# EAGLE design sx1 (EAGLE 5.11)
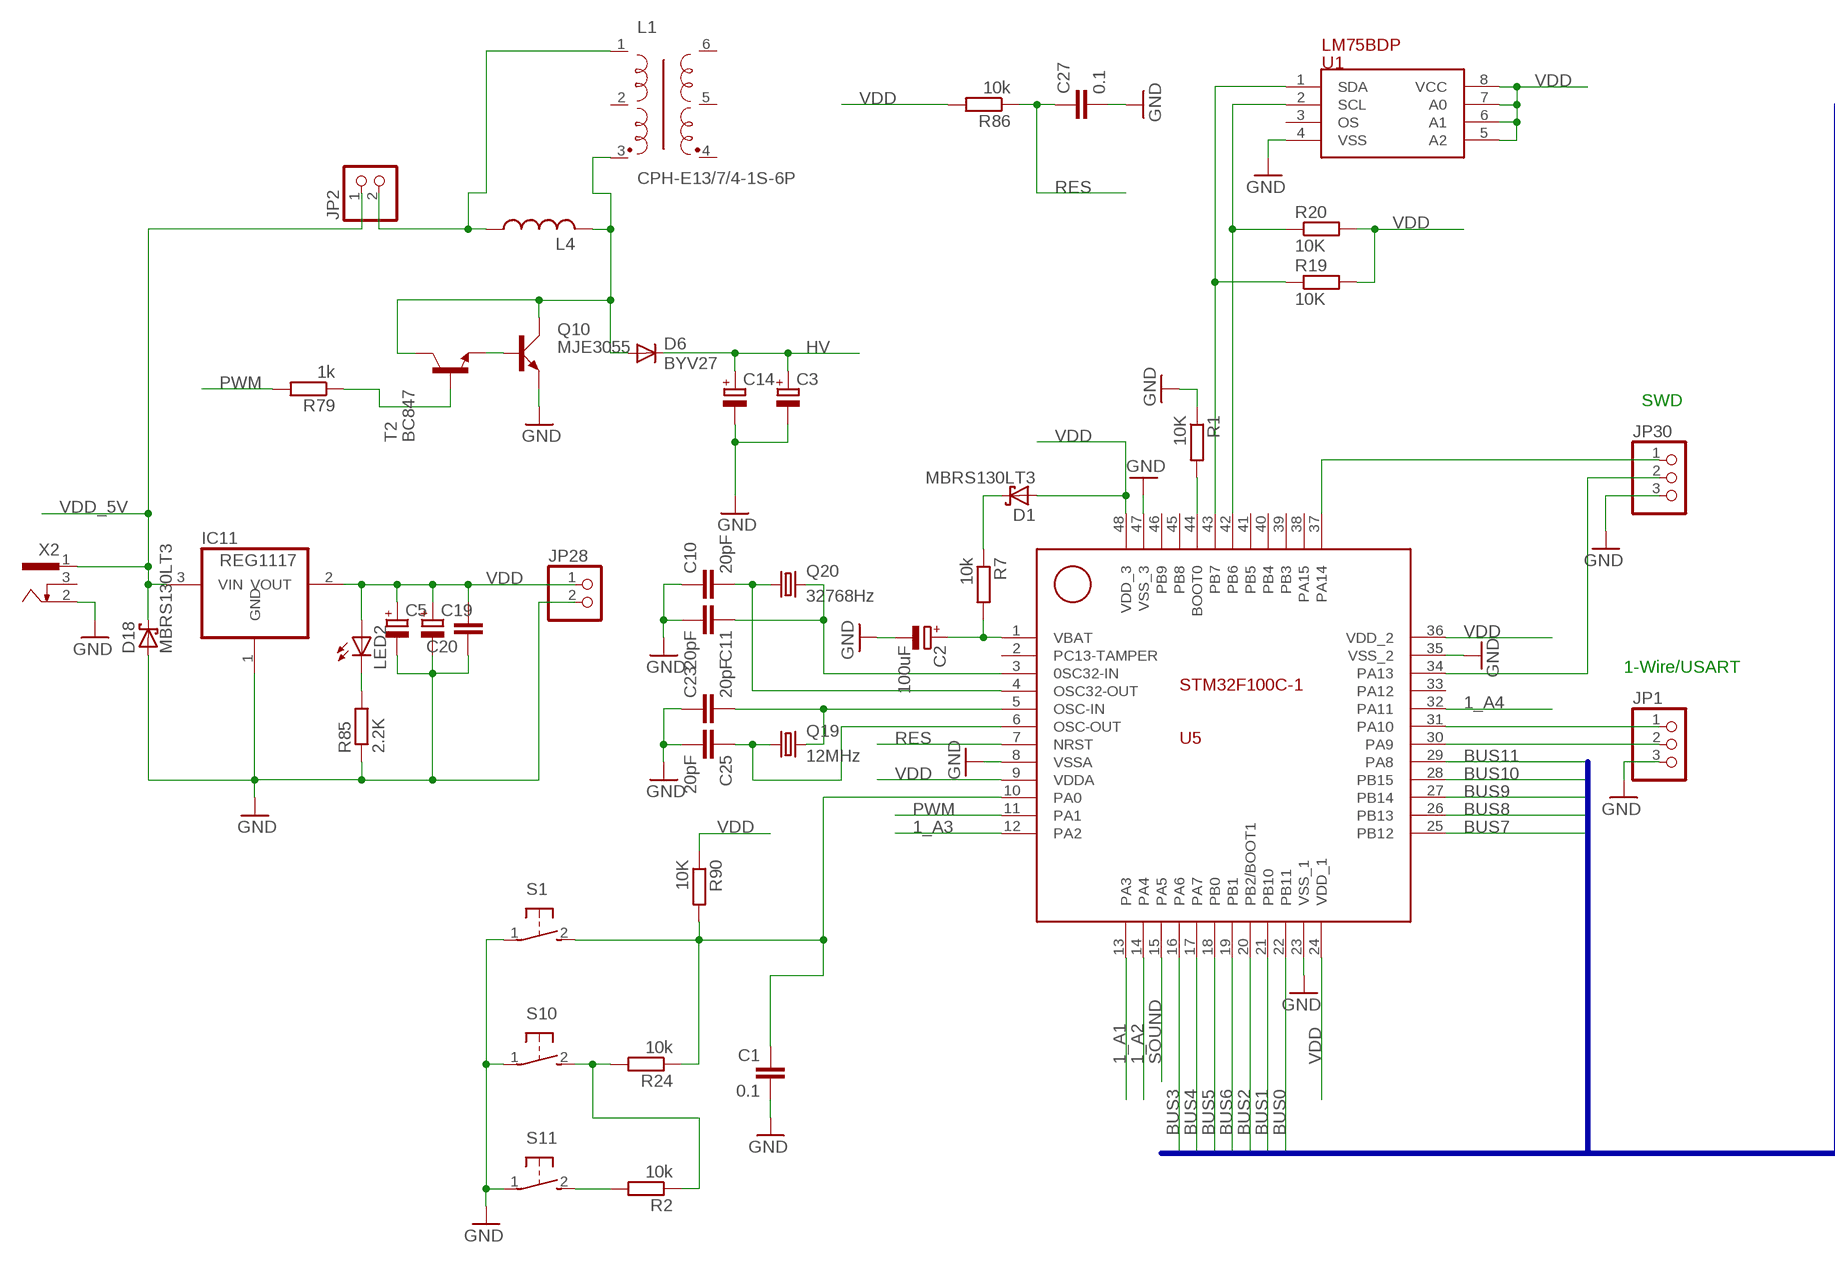
[diagram p0: schematic, sheet 1, part 1 of 2]
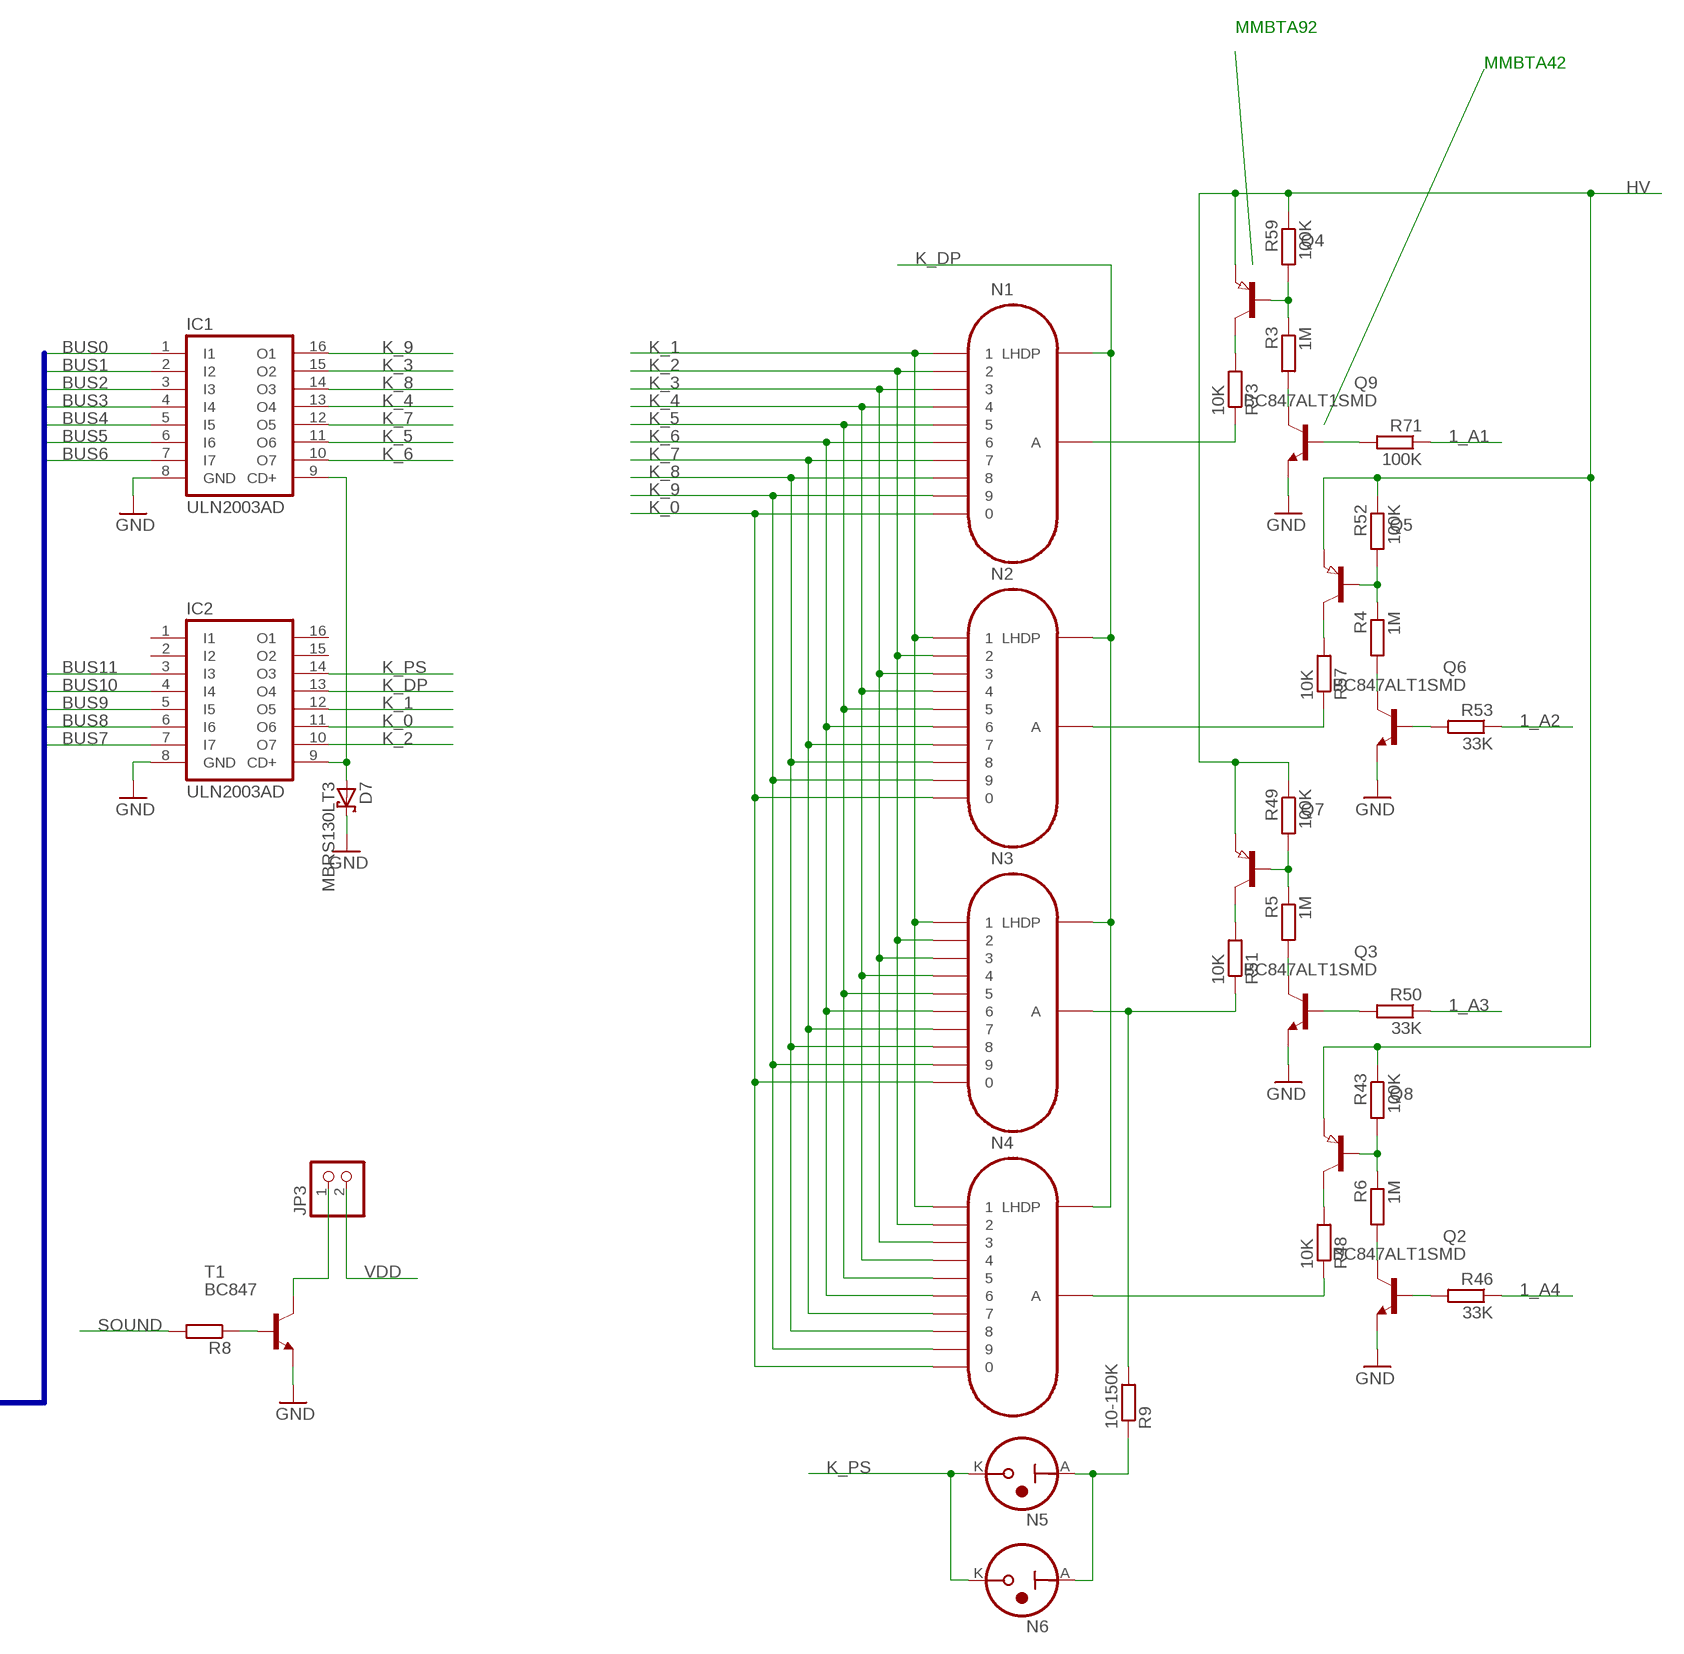
[diagram p1: schematic, sheet 1, part 2 of 2]

## Parts
C1  0.1  C-EUC0805K  [C0805K]
C2  100uF  CPOL-EUSMCC  [SMC_C]
C3  CPOL-EUSANYO_E9  [SANYO-OSCON_E9]
C5  CPOL-EUSMCC  [SMC_C]
C10  20pF  C-EUC0805K  [C0805K]
C11  20pF  C-EUC0805K  [C0805K]
C14  CPOL-EUSMCC  [SMC_C]
C19  CPOL-EUSMCC  [SMC_C]
C20  C-EUC0805K  [C0805K]
C23  20pF  C-EUC0805K  [C0805K]
C25  20pF  C-EUC0805K  [C0805K]
C27  0.1  C-EUC0805K  [C0805K]
D1  MBRS130LT3  [SMB]
D6  BYV27  [SOD57-10]
D7  MBRS130LT3  [SMB]
D18  MBRS130LT3  [SMB]
IC1  ULN2003AD  [SO16]
IC2  ULN2003AD  [SO16]
IC11  REG1117  [SOT223]
JP1  PINHD-1X3  [1X03]
JP2  PINHD-1X2  [1X02]
JP3  PINHD-1X2  [1X02]
JP28  PINHD-1X2  [1X02]
JP30  PINHD-1X3  [1X03]
L1  CPH-E13/7/4-1S-6P  [CPH-E13/7/4-1S-6P]
L4  L-USL4532P  [L4532P]
LED2  LEDCHIPLED_0805  [CHIPLED_0805]
N1  IN-12B  [IN-12]
N2  IN-12B  [IN-12]
N3  IN-12B  [IN-12]
N4  IN-12B  [IN-12]
N5  IN-6  [IN-6]
N6  IN-6  [IN-6]
Q2  BC847ALT1SMD  [SOT23]
Q3  BC847ALT1SMD  [SOT23]
Q4  PNP-TRANSISTOR_SOT23  [SOT23]
Q5  PNP-TRANSISTOR_SOT23  [SOT23]
Q6  BC847ALT1SMD  [SOT23]
Q7  PNP-TRANSISTOR_SOT23  [SOT23]
Q8  PNP-TRANSISTOR_SOT23  [SOT23]
Q9  BC847ALT1SMD  [SOT23]
Q10  MJE3055  [TO220AV]
Q19  12MHz  CRYSTALHC49S  [HC49/S]
Q20  32768Hz  CRYSTALTC26H  [TC26H]
R1  10K  R-EU_R0805  [R0805]
R2  10k  R-EU_R0805  [R0805]
R3  1M  R-EU_R0805  [R0805]
R4  1M  R-EU_R0805  [R0805]
R5  1M  R-EU_R0805  [R0805]
R6  1M  R-EU_R0805  [R0805]
R7  10k  R-EU_R0805  [R0805]
R8  R-EU_R0805  [R0805]
R9  10-150K  R-EU_R0805  [R0805]
R19  10K  R-EU_R0805  [R0805]
R20  10K  R-EU_R0805  [R0805]
R24  10k  R-EU_R0805  [R0805]
R43  100K  R-EU_R0805  [R0805]
R46  33K  R-EU_R0805  [R0805]
R48  10K  R-EU_R0805  [R0805]
R49  100K  R-EU_R0805  [R0805]
R50  33K  R-EU_R0805  [R0805]
R51  10K  R-EU_R0805  [R0805]
R52  100K  R-EU_R0805  [R0805]
R53  33K  R-EU_R0805  [R0805]
R57  10K  R-EU_R0805  [R0805]
R59  100K  R-EU_R0805  [R0805]
R71  100K  R-EU_R0805  [R0805]
R73  10K  R-EU_R0805  [R0805]
R79  1k  R-EU_R0805  [R0805]
R85  2.2K  R-EU_R0805  [R0805]
R86  10k  R-EU_R0805  [R0805]
R90  10K  R-EU_R0805  [R0805]
S1  31-XX  [B3F-31XX]
S10  31-XX  [B3F-31XX]
S11  31-XX  [B3F-31XX]
T1  BC847  [SOT23]
T2  BC847  [SOT23]
U1  LM75BDP  [TSSOP8]
U5  STM32F100C-1  [LQFP48]
X2  733980-62  [733980-62]

## Nets
1_A1: R71.1 U5.13(PA3)
1_A2: R53.1 U5.14(PA4)
1_A3: R50.1 U5.12(PA2)
1_A4: R46.1 U5.32(PA11)
BUS0: IC1.1(I1) U5.22(PB11)
BUS1: IC1.2(I2) U5.21(PB10)
BUS2: IC1.3(I3) U5.20(PB2/BOOT1)
BUS3: IC1.4(I4) U5.16(PA6)
BUS4: IC1.5(I5) U5.17(PA7)
BUS5: IC1.6(I6) U5.18(PB0)
BUS6: IC1.7(I7) U5.19(PB1)
BUS7: IC2.7(I7) U5.25(PB12)
BUS8: IC2.6(I6) U5.26(PB13)
BUS9: IC2.5(I5) U5.27(PB14)
BUS10: IC2.4(I4) U5.28(PB15)
BUS11: IC2.3(I3) U5.29(PA8)
GND: C1.2 C2.- C3.- C5.- C10.1 C11.2 C14.- C19.- C20.1 C23.1 C25.2 C27.2 D7.C D18.A IC1.8(GND) IC2.8(GND) IC11.1(GND) JP1.3 JP28.2 JP30.3 Q2.2(E) Q3.2(E) Q6.2(E) Q9.2(E) Q10.E R1.1 R85.1 S1.1(P) S10.1(P) S11.1(P) T1.2(E) U1.4(VSS) U5.8(VSSA) U5.23(VSS_1) U5.35(VSS_2) U5.47(VSS_3) X2.2
HV: C3.+ C14.+ D6.C Q4.2(E) Q5.2(E) Q7.2(E) Q8.2(E) R43.1 R49.1 R52.1 R59.1
K_0: IC2.11(O6) N1.0 N2.0 N3.0 N4.0
K_1: IC2.12(O5) N1.1 N2.1 N3.1 N4.1
K_2: IC2.10(O7) N1.2 N2.2 N3.2 N4.2
K_3: IC1.15(O2) N1.3 N2.3 N3.3 N4.3
K_4: IC1.13(O4) N1.4 N2.4 N3.4 N4.4
K_5: IC1.11(O6) N1.5 N2.5 N3.5 N4.5
K_6: IC1.10(O7) N1.6 N2.6 N3.6 N4.6
K_7: IC1.12(O5) N1.7 N2.7 N3.7 N4.7
K_8: IC1.14(O3) N1.8 N2.8 N3.8 N4.8
K_9: IC1.16(O1) N1.9 N2.9 N3.9 N4.9
K_DP: IC2.13(O4) N1.LHDP N2.LHDP N3.LHDP N4.LHDP
K_PS: IC2.14(O3) N5.K N6.K
N$1: Q10.B T2.2(E)
N$2: D6.A L1.3 L4.2 Q10.C T2.3(C)
N$3: Q8.1(B) R6.1 R43.2
N$4: Q2.1(B) R46.2
N$5: Q8.3(C) R48.2
N$6: Q7.1(B) R5.1 R49.2
N$7: C2.+ R7.2 U5.1(VBAT)
N$8: D1.C R7.1
N$9: R79.1 T2.1(B)
N$10: R19.1 U1.1(SDA) U5.43(PB7)
N$11: R20.1 U1.2(SCL) U5.42(PB6)
N$12: R8.1 T1.1(B)
N$13: JP1.2 U5.30(PA9)
N$14: JP3.1 T1.3(C)
N$15: JP2.2 L1.1 L4.1
N$17: N5.A N6.A R9.1
N$19: Q3.1(B) R50.2
N$20: Q7.3(C) R51.2
N$22: Q9.3(C) R3.2
N$23: Q3.3(C) R5.2
N$24: Q2.3(C) R6.2
N$25: Q6.3(C) R4.2
N$26: R1.2 U5.44(BOOT0)
N$27: R2.2 S11.2(S)
N$28: JP30.2 U5.34(PA13)
N$29: JP30.1 U5.37(PA14)
N$30: JP1.1 U5.31(PA10)
N$31: R2.1 R24.2 S10.2(S)
N$32: N3.A R9.2 R51.1
N$36: C25.1 Q19.1 U5.6(OSC-OUT)
N$39: C23.2 Q19.2 U5.5(OSC-IN)
N$42: C11.1 Q20.2 U5.3(0SC32-IN)
N$43: C10.2 Q20.1 U5.4(OSC32-OUT)
N$44: Q5.1(B) R4.1 R52.2
N$61: Q6.1(B) R53.2
N$62: Q5.3(C) R57.2
N$72: Q4.1(B) R3.1 R59.2
N$76: Q9.1(B) R71.2
N$87: Q4.3(C) R73.2
N$95: N2.A R57.1
N$97: N1.A R73.1
N$99: D7.A IC1.9(CD+) IC2.9(CD+)
N$105: N4.A R48.1
N$157: C1.1 R24.1 R90.2 S1.2(S) U5.10(PA0)
N$163: LED2.C R85.2
PWM: R79.2 U5.11(PA1)
RES: C27.1 R86.1 U5.7(NRST)
SOUND: R8.2 U5.15(PA5)
VDD: C5.+ C19.+ C20.2 D1.A IC11.2(VOUT) JP3.2 JP28.1 LED2.A R19.2 R20.2 R86.2 R90.1 U1.5(A2) U1.6(A1) U1.7(A0) U1.8(VCC) U5.9(VDDA) U5.24(VDD_1) U5.36(VDD_2) U5.48(VDD_3)
VDD_5V: D18.C IC11.3(VIN) JP2.1 X2.1
Unconnected: IC2.1(I1) IC2.2(I2) IC2.15(O2) IC2.16(O1) L1.2 L1.4 L1.5 L1.6 U1.3(OS) U5.2(PC13-TAMPER) U5.33(PA12) U5.38(PA15) U5.39(PB3) U5.40(PB4) U5.41(PB5) U5.45(PB8) U5.46(PB9) X2.3

## Buses
BUS[0..12]

## Notes on the sheet
- MMBTA92
- MMBTA42
- SWD
- 1-Wire/USART

## Library data of the parts
C1 C10 C11 C20 C23 C25 C27 = rcl:C-EU: CAPACITOR, European symbol
C2 C3 C5 C14 C19 = rcl:CPOL-EU: POLARIZED CAPACITOR, European symbol
D1 D7 D18 = diode:MBRS130LT3: Schottky Power Rectifier Source: http://www.onsemi.com/pub/Collateral/MBRS130LT3-D.PDF
D6 = diode:BYV27: DIODE ultra fast
IC1 IC2 = uln-udn:ULN2003A: DRIVER ARRAY
IC11 = burr-brown:REG1117: 800mA and 1A Low Dropout (LDO) Positive Regulator 1.8V, 2.5V, 2.85V, 3.3V, 5V, and Adj; MPN: REG1117; OC_FARNELL: 1097566; OC_NEWARK: 14P6981
JP1 JP30 = pinhead:PINHD-1X3: PIN HEADER
JP2 JP3 JP28 = pinhead:PINHD-1X2: PIN HEADER
L1 = inductors:CPH-E13/7/4-1S-6P: 6-pins E13/7/4 coil former (EF12.6) Source: Ferroxcube Ecore.pdf
L4 = rcl:L-US: INDUCTOR, American symbol
LED2 = led:LED: LED OSRAM: - CHIPLED LG R971, LG N971, LY N971, LG Q971, LY Q971, LO R971, LY R971 LH N974, LH R974 LS Q976, LO Q976, LY Q976 LO Q996 - Hyper CHIPLED LW Q18S LB Q993, LB Q99A, LB R99A - SideLED LS A670, LO A670, LY A670, LG A670, LP A670 LB A673, LV A673, LT A673, LW A673 LH A674 LY A675 LS A676, LA A676, LO A676, LY A676, LW A676 LS A679, LY A679, LG A679 - Hyper Micro SIDELED® LS Y876, LA Y876, LO Y876, LY Y876 LT Y87S - SmartLED LW L88C, LW L88S LB L89C, LB L89S, LG L890 LS L89K, LO L89K, LY L89K LS L896, LA L896, LO L896, LY L896 - TOPLED LS T670, LO T670, LY T670, LG T670, LP T670 LSG T670, LSP T670, LSY T670, LOP T670, LYG T670 LG T671, LOG T671, LSG T671 LB T673, LV T673, LT T673, LW T673 LH T674 LS T676, LA T676, LO T676, LY T676, LB T676, LH T676, LSB T676, LW T676 LB T67C, LV T67C, LT T67C, LS T67K, LO T67K, LY T67K, LW E67C LS E67B, LA E67B, LO E67B, LY E67B, LB E67C, LV E67C, LT E67C LW T67C LS T679, LY T679, LG T679 LS T770, LO T770, LY T770, LG T770, LP T770 LB T773, LV T773, LT T773, LW T773 LH T774 LS E675, LA E675, LY E675, LS T675 LS T776, LA T776, LO T776, LY T776, LB T776 LHGB T686 LT T68C, LB T68C - Hyper Mini TOPLED® LB M676 - Mini TOPLED Santana® LG M470 LS M47K, LO M47K, LY M47K Source: http://www.osram.convergy.de LUXEON: - LUMILED® LXK2-PW12-R00, LXK2-PW12-S00, LXK2-PW14-U00, LXK2-PW14-V00 LXK2-PM12-R00, LXK2-PM12-S00, LXK2-PM14-U00 LXK2-PE12-Q00, LXK2-PE12-R00, LXK2-PE12-S00, LXK2-PE14-T00, LXK2-PE14-U00 LXK2-PB12-K00, LXK2-PB12-L00, LXK2-PB12-M00, LXK2-PB14-N00, LXK2-PB14-P00, LXK2-PB14-Q00 LXK2-PR12-L00, LXK2-PR12-M00, LXK2-PR14-Q00, LXK2-PR14-R00 LXK2-PD12-Q00, LXK2-PD12-R00, LXK2-PD12-S00 LXK2-PH12-R00, LXK2-PH12-S00 LXK2-PL12-P00, LXK2-PL12-Q00, LXK2-PL12-R00 Source: www.luxeon.com KINGBRIGHT: KA-3528ASYC Source: www.kingbright.com
N1-N4 = russian-nixies:IN-12B: IN-12B: medium numeric topview nixie tube
N5 N6 = russian-nixies:IN-6: IN-6: dual nixie bulb
Q2 Q3 Q6 Q9 = transistor-npn:BC847*: NPN Transistor
Q4 Q5 Q7 Q8 = semicon-smd-ipc:PNP-TRANSISTOR_: PNP TRANSISTOR
Q10 = transistor-power:MJE3055: NPN TRANSISTOR
Q19 = crystal:CRYSTAL: CRYSTAL; OC_FARNELL: 1667008; OC_NEWARK: unknown
Q20 = crystal:CRYSTAL: CRYSTAL; OC_FARNELL: unknown; OC_NEWARK: unknown
R1-R9 R19 R20 R24 R43 R46 R48-R53 R57 R59 R71 R73 R79 R86 R90 = rcl2:R-EU_: RESISTOR, European symbol
R85 = rcl:R-EU_: RESISTOR, European symbol
S1 S10 S11 = switch-omron:31-XX: OMRON SWITCH; MPN: B3F-3100; OC_FARNELL: 959704; OC_NEWARK: 36M3582
T1 T2 = transistor-neu-to92:BC847: NPN TRANSISTOR
U1 = 01My_def_envir:LM75BDP
U5 = 01My_def_envir:STM32F100C-1
X2 = con-conrad:73398?: FEMALE PRINT CONNECTOR Niedervolt-Steckverbinder Distributor Conrad

## Board
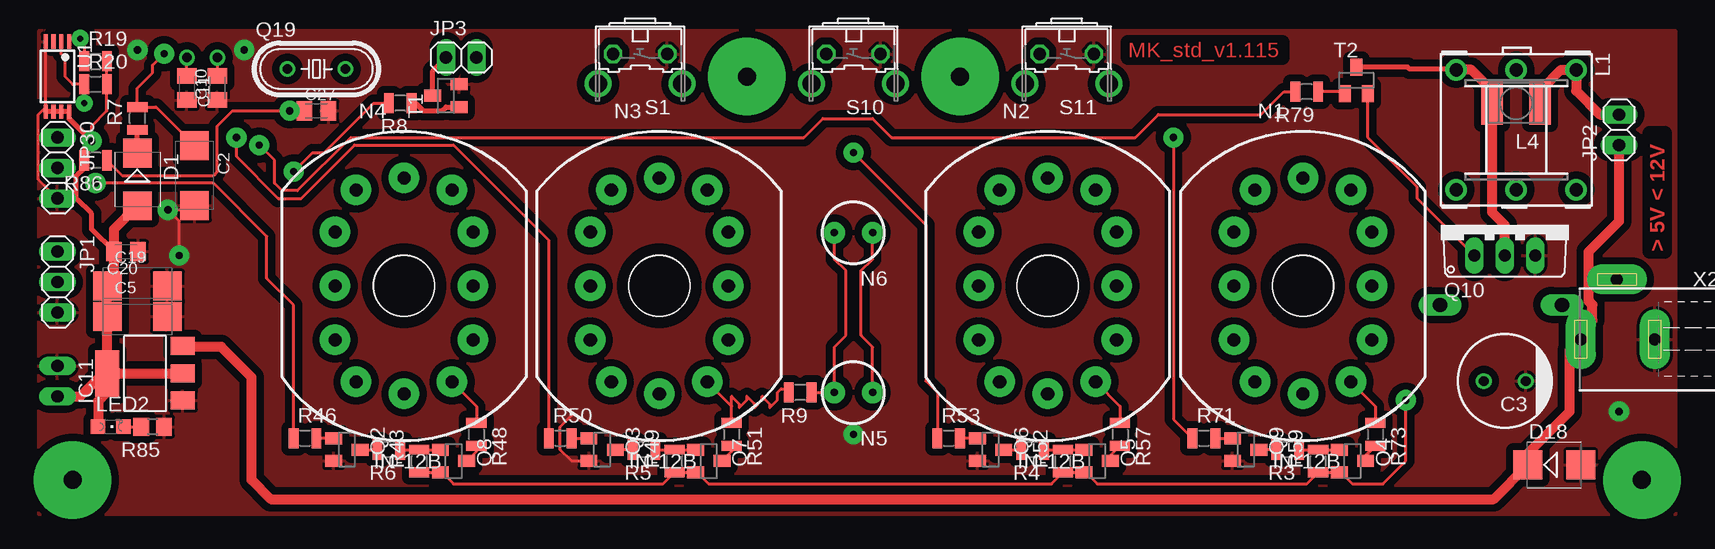
[diagram p2: board, top side]
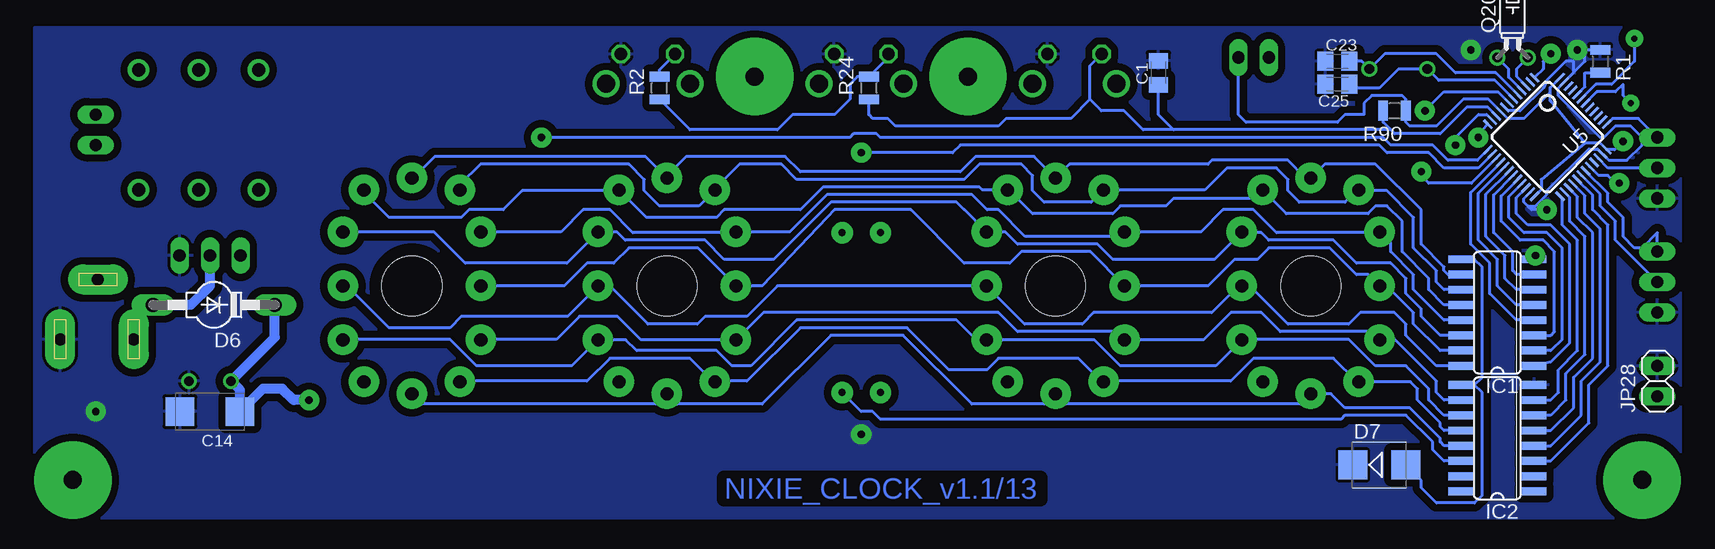
[diagram p3: board, bottom side, seen from below]

No outline drawn. Coordinates in mm, seen from the top.
Copper layers (1*16): Top 0.035mm / dielectric 1.5mm / Bottom 0.035mm
Design rules "default *": minimum track width 10mil, minimum drill 24mil, track to track 8mil, track to pad 8mil, pad to pad 8mil, via to via 8mil, smd to smd 8mil, copper to edge 40mil, drill to drill 8mil, minimum pad ring 10mil, minimum via ring 8mil, stop-mask expansion 4mil, vias tented up to drill 0mil, thermal gap 10mil

### Footprints (pad centres in the part's own frame; a part is rotated, then mirrored left to right if it is on the bottom)
C0805K = smd 1.3 x 1.6: 1 -1,0; 2 1,0
SMC_C = smd 2.4 x 2.4: + -2.5,0; - 2.5,0
SANYO-OSCON_E9 = drill 0.8 pad 1.27 round: + 1.75,0; - -1.75,0
SMB = smd 2.4 x 2.4: A 2.2,0; C -2.2,0
SOD57-10 = drill 1.194 long: A 5.08,0; C -5.08,0
SO16 = smd 0.66 x 2.032: 1 -4.445,-3.073; 2 -3.175,-3.073; 3 -1.905,-3.073; 4 -0.635,-3.073; 5 0.635,-3.073; 6 1.905,-3.073; 7 3.175,-3.073; 8 4.445,-3.073; 9 4.445,3.073; 10 3.175,3.073; 11 1.905,3.073; 12 0.635,3.073; 13 -0.635,3.073; 14 -1.905,3.073; 15 -3.175,3.073; 16 -4.445,3.073
SOT223 = smd 1.499 x 2.007: 1 -2.261,-3.15; 2 0.025,-3.15; 3 2.311,-3.15 | smd 3.81 x 2.007: 4 0,3.15
1X03 = drill 1.016 long: 1 -2.54,0; 2 0,0; 3 2.54,0
1X02 = drill 1.016 long: 1 -1.27,0; 2 1.27,0
CPH-E13/7/4-1S-6P = drill 1.1 pad 1.778 round: 1 -5,5; 2 -5,0; 3 -5,-5; 4 5,-5; 5 5,0; 6 5,5
L4532P = smd 1.8 x 3.6: 1 -2,0; 2 2,0
CHIPLED_0805 = smd 1.2 x 1.2: A 0,-1.05; C 0,1.05
IN-12 = drill 1.1 pad 2.54 round: 0 5.75,-4.5; 1 -4,-8; 2 -5.75,-4.5; 3 -5.75,0; 4 -5.75,4.5; 5 -4,8; 6 0,9; 7 4,8; 8 5.75,4.5; 9 5.75,0; A 4,-8; LHDP 0,-9 | hole 5: 0,0
IN-6 = drill 0.6 pad 1.778 round: A -1.6,0; K 1.6,0
SOT23 = smd 1 x 1.4: 1 -0.95,-1.1; 2 0.95,-1.1; 3 0,1.1
TO220AV = drill 1.016 long: B -2.54,-2.54; C 0,-2.54; E 2.54,-2.54
HC49/S = drill 0.813 round: 1 -2.413,0; 2 2.413,0
TC26H = drill 0.813 round: 1 -1.27,0; 2 1.27,0
R0805 = smd 0.813 x 1.676: 1 -0.95,0; 2 0.95,0
R0805' = smd 1.3 x 1.5: 1 -0.95,0; 2 0.95,0
B3F-31XX = drill 1.016 octagon: 1 -2.261,-1.245; 2 2.261,-1.245 | drill 1.499 pad 2.159 round: 3 -3.505,1.245; 4 3.505,1.245
TSSOP8 = smd 1.2 x 0.35: 1 -2.925,0.975; 2 -2.925,0.325; 3 -2.925,-0.325; 4 -2.925,-0.975; 5 2.925,-0.975; 6 2.925,-0.325; 7 2.925,0.325; 8 2.925,0.975
LQFP48 = smd 0.2 x 1: 1 -2.75,-4.25; 2 -2.25,-4.25; 3 -1.75,-4.25; 4 -1.25,-4.25; 5 -0.75,-4.25; 6 -0.25,-4.25; 7 0.25,-4.25; 8 0.75,-4.25; 9 1.25,-4.25; 10 1.75,-4.25; 11 2.25,-4.25; 12 2.75,-4.25; 25 2.75,4.25; 26 2.25,4.25; 27 1.75,4.25; 28 1.25,4.25; 29 0.75,4.25; 30 0.25,4.25; 31 -0.25,4.25; 32 -0.75,4.25; 33 -1.25,4.25; 34 -1.75,4.25; 35 -2.25,4.25; 36 -2.75,4.25 | smd 1 x 0.2: 13 4.25,-2.75; 14 4.25,-2.25; 15 4.25,-1.75; 16 4.25,-1.25; 17 4.25,-0.75; 18 4.25,-0.25; 19 4.25,0.25; 20 4.25,0.75; 21 4.25,1.25; 22 4.25,1.75; 23 4.25,2.25; 24 4.25,2.75; 37 -4.25,2.75; 38 -4.25,2.25; 39 -4.25,1.75; 40 -4.25,1.25; 41 -4.25,0.75; 42 -4.25,0.25; 43 -4.25,-0.25; 44 -4.25,-0.75; 45 -4.25,-1.25; 46 -4.25,-1.75; 47 -4.25,-2.25; 48 -4.25,-2.75
733980-62 = drill 1 pad 2.5 long: 1 0,8.57; 2 0,2.42; 3 5,5.57

### Placement (x,y rotation side)
C1  43.5,37.15 90 bottom
C2  13.34,28.57 270 top
C3  122.56,11.43 180 top
C5  8.57,16.83 0 top
C10  15.24,35.88 90 top
C11  12.7,35.88 270 top
C14  122.56,8.89 180 bottom
C19  8.57,19.37 0 top
C20  7.62,22.23 180 top
C23  28.57,38.1 0 bottom
C25  28.57,36.2 180 bottom
C27  23.5,33.97 0 top
D1  8.57,28.26 270 top
D6  122.24,17.78 180 bottom
D7  25.08,4.45 0 bottom
D18  126.68,4.45 0 top
IC1  15.24,17.14 90 bottom
IC2  15.24,6.67 90 bottom
IC11  9.21,12.06 90 top
JP1  1.91,19.68 270 top
JP2  132.08,32.38 90 top
JP3  35.56,38.42 0 top
JP28  1.91,11.43 90 bottom
JP30  1.91,29.21 270 top
L1  123.51,32.38 270 top
L4  123.51,34.61 180 top
LED2  6.35,7.62 270 top
N1  105.73,19.37 0 top
N2  84.45,19.37 0 top
N3  52.07,19.37 0 top
N4  30.8,19.37 0 top
N5  68.26,10.48 0 top
N6  68.26,23.81 0 top
Q2  26.04,5.71 270 top
Q3  47.31,5.71 270 top
Q4  109.86,4.76 270 top
Q5  88.58,4.76 270 top
Q6  79.69,5.71 270 top
Q7  56.2,4.76 270 top
Q8  34.92,4.76 270 top
Q9  100.97,5.71 270 top
Q10  122.56,24.45 0 top
Q19  23.5,37.47 0 top
Q20  13.97,38.42 0 bottom
R1  6.67,38.1 270 bottom
R2  85.09,35.88 90 bottom
R3  104.46,5.71 180 top
R4  83.19,5.71 180 top
R5  50.8,5.71 180 top
R6  29.53,5.71 180 top
R7  8.57,33.34 90 top
R8  30.48,34.61 180 top
R9  63.82,10.48 180 top
R19  5.08,38.1 0 top
R20  5.08,36.2 0 top
R24  67.63,35.88 90 bottom
R43  32.07,4.76 90 top
R46  22.54,6.67 0 top
R48  36.83,6.99 270 top
R49  53.34,4.76 90 top
R50  43.81,6.67 0 top
R51  58.1,6.99 270 top
R52  85.72,4.76 90 top
R53  76.2,6.67 0 top
R57  90.49,6.99 270 top
R59  107,4.76 90 top
R71  97.47,6.67 0 top
R73  111.76,6.99 270 top
R79  106.05,35.56 180 top
R85  2.2K  [R0805']  9.84,7.62 180 top
R86  5.08,29.84 180 top
R90  23.81,33.97 180 bottom
S1  50.48,37.47 180 top
S10  68.26,37.47 180 top
S11  86.04,37.47 180 top
T1  34.29,35.24 90 top
T2  110.17,36.51 0 top
U1  1.91,36.83 270 top
U5  11.07,31.79 225 bottom
X2  137.48,14.92 90 top

### Tracks (layer width: path | path; a pad name or v marks a point on that pad's centre or on a via)
1_A1  (via drill 0.6 pad 1.68)
  Top 0.254: R71.1 94.94,8.25 94.93,9.84 v94.93,31.75
  Bottom 0.254: U5.13 16.91,29.84 19.37,29.84 20.64,31.11 24.13,31.11 24.77,31.75 66.67,31.75 66.99,32.07 68.9,32.07 69.22,31.75 v94.93,31.75
1_A2  (via drill 0.6 pad 1.68)
  Top 0.254: R53.1 75.25,10.47 74.3,11.43 74.3,24.45 v68.26,30.48
  Bottom 0.254: U5.14 16.83,29.21 19.68,29.21 20.95,30.48 24.45,30.48 25.08,31.11 60.01,31.11 60.64,30.48 v68.26,30.48
1_A3  (via drill 0.6 pad 1.68)
  Top 0.254: R50.1 42.87,23.18 34.92,31.11 26.67,31.11 22.23,26.67 20.32,26.67 16.83,30.16 v16.83,31.75
  Bottom 0.254: U5.12 16.51,32.36 v16.83,31.75
1_A4  (via drill 0.6 pad 1.68)
  Top 0.254: v5.08,27.94 14.92,27.94 19.37,23.5 19.37,20 21.59,17.78 R46.1
  Bottom 0.254: U5.32 6.8,28.57 6.03,28.57 5.4,27.94 v5.08,27.94
BUS0
  Bottom 0.254: U5.22 13.65,26.73 13.65,25.4 12.7,24.45 10.79,24.45 9.21,22.86 9.21,14.61 10.79,13.02 IC1.1
BUS1
  Bottom 0.254: U5.21 14.29,26.81 14.29,25.08 13.02,23.81 11.11,23.81 9.84,22.54 9.84,14.92 10.79,13.97 IC1.2
BUS2
  Bottom 0.254: U5.20 14.92,26.88 14.92,24.77 13.34,23.18 11.43,23.18 10.48,22.23 10.48,15.56 10.79,15.24 IC1.3
BUS3
  Bottom 0.254: U5.16 17.46,27.17 17.46,22.86 15.88,21.27 15.88,18.73 13.65,16.51 IC1.4
BUS4
  Bottom 0.254: U5.17 16.83,27.1 16.83,23.18 15.24,21.59 15.24,19.37 13.65,17.78 IC1.5
BUS5
  Bottom 0.254: U5.18 16.19,27.02 16.19,23.5 14.61,21.91 14.61,20 13.65,19.05 IC1.6
BUS6
  Bottom 0.254: U5.19 15.56,26.95 15.56,23.81 13.97,22.23 13.97,20.64 13.65,20.32 IC1.7
BUS7
  Bottom 0.254: U5.25 9.84,26.67 9.84,24.45 8.57,23.18 8.57,13.97 10.16,12.38 10.16,10.48 10.79,9.84 IC2.7
BUS8
  Bottom 0.254: U5.26 9.21,26.74 9.21,24.77 7.94,23.5 7.94,13.65 9.53,12.06 9.53,9.84 10.79,8.57 IC2.6
BUS9
  Bottom 0.254: U5.27 8.57,26.81 8.57,25.08 7.3,23.81 7.3,13.34 8.89,11.75 8.89,9.21 10.79,7.3 IC2.5
BUS10
  Bottom 0.254: U5.28 7.94,26.88 7.94,25.4 6.67,24.13 6.67,13.02 8.26,11.43 8.26,8.57 10.79,6.03 IC2.4
BUS11
  Bottom 0.254: U5.29 7.3,26.96 7.3,25.72 6.03,24.45 6.03,12.7 7.62,11.11 7.62,7.94 10.79,4.76 IC2.3
GND  (via drill 0.6 pad 1.68)
  Top 0.254: 46.36,4.76 Q3.2 44.77,4.76 43.81,5.71 43.81,7.62 44.77,8.57 | 13.29,26.04 C2.- 13.06,26.07 12.7,25.72 v11.11,25.72 12.06,24.77 v12.06,21.91 | U1.4 0.93,34.27 0.32,33.66 0.32,28.26 JP30.3
  Bottom 0.254: U5.23 13.02,26.67 13.02,26.35 12.7,26.04 | 12.7,26.04 12.06,26.04 11.11,26.99 11.11,27.3 7.62,30.8 6.9,30.8 U5.35 5.95,29.84 4.45,29.84 3.17,31.11 3.17,31.75 4.13,32.7 5.4,32.7 6.35,31.75 6.67,31.75 10.16,35.24 10.16,35.88 U5.47 | U5.47 7.94,38.11 7.94,39.05 7.93,39.05 R1.1 | U5.47 8.89,37.15 8.89,38.1 9.53,38.1 11.11,36.51 11.43,35.88 13.34,33.97 14.32,33.97 U5.8 | 12.7,26.04 12.38,25.72 v11.11,25.72 | IC1.8 12.17,21.81 v12.06,21.91
  other vias: 132.08,8.89 68.26,6.99 8.57,39.05 17.46,39.05
  pour Bottom (isolate 0.61): 0,0 137.16,0 137.16,40.96 0,40.96
  pour Top (isolate 0.61): 0.32,0.32 136.84,0.32 136.84,40.64 0.32,40.64
HV  (via drill 0.6 pad 1.68)
  Top 0.254: Q4.2 R59.1 106.04,2.86 88.58,2.86 87.63,3.81 Q5.2 R52.1 84.77,2.86 56.2,2.86 55.24,3.81 Q7.2 R49.1 52.38,2.86 34.92,2.86 33.97,3.81 Q8.2 R43.1 | 109.08,3.81 109.08,3.64 109.86,2.86 112.39,2.86 114.3,4.76 v114.3,9.84
  Top 0.305: Q4.2 109.08,3.81
  Bottom 0.813: D6.C 117.16,15.08 C3.+ 120.06,10.68 C14.+ 118.15,10.79 116.52,10.79 115.57,9.84 v114.3,9.84
K_0
  Bottom 0.254: N1.0 111.42,14.92 102.55,14.92 100.33,12.7 92.39,12.7 90.22,14.87 N2.0 87.89,14.87 87,13.97 80.33,13.97 79.06,12.7 77.47,12.7 73.66,16.51 60.33,16.51 58.68,14.87 N3.0 48.84,14.87 46.67,12.7 38.72,12.7 N4.0 36.25,14.87 36.2,14.92 27.62,14.92 25.4,12.7 22.86,12.7 20.95,10.79 20.95,9.84 19.68,8.57 IC2.11
K_1
  Bottom 0.254: 80.39,11.43 N2.1 80.58,11.37 80.64,11.43 | N1.1 101.67,11.43 91.12,11.43 89.22,13.34 82.55,13.34 80.64,11.43 | 80.64,11.43 77.79,11.43 73.34,15.88 64.45,15.88 60.96,12.38 57.78,12.38 56.83,13.34 50.16,13.34 48.2,11.37 N3.1 48.01,11.43 37.47,11.43 35.56,13.34 28.89,13.34 26.93,11.37 N4.1 22.48,11.37 21.91,10.79 21.91,9.84 20,7.94 20,7.62 19.68,7.3 IC2.12
K_2
  Bottom 0.254: N1.2 99.92,14.92 93.66,14.92 91.76,16.83 88.58,16.83 86.62,14.87 N2.2 76.43,17.14 56.83,17.14 55.24,15.56 47.01,15.56 N3.2 39.74,14.87 37.47,17.14 34.92,17.14 33.34,15.56 25.74,15.56 N4.2 23.76,14.87 20.32,11.43 20.32,10.48 19.68,9.84 IC2.10
K_3
  Bottom 0.254: N1.3 93.03,19.37 91.12,21.27 88.9,21.27 87.63,22.54 81.88,22.54 N2.3 76.52,19.37 71.12,25.08 70.48,25.72 64.14,25.72 59.69,21.27 55.88,21.27 54.93,22.23 49.18,22.23 N3.3 39.37,19.37 37.15,21.59 35.24,21.59 34.29,22.54 29.21,22.54 26.99,20.32 26,20.32 N4.3 24.45,19.37 22.23,17.14 22.23,16.19 20,13.97 IC1.15
K_4
  Bottom 0.254: N1.4 93.29,23.87 91.44,25.72 89.22,25.72 87.31,23.81 78.76,23.81 N2.4 74.24,23.87 71.12,26.99 59.05,26.99 57.78,25.72 56.83,25.72 54.61,23.5 46.69,23.5 N3.4 39.95,23.87 38.1,25.72 35.56,25.72 33.66,23.81 25.1,23.81 N4.4 24.13,22.95 24.13,22.23 22.23,20.32 22.23,19.05 19.68,16.51 IC1.13
K_5
  Bottom 0.254: N1.5 101.73,27.81 100.01,29.53 87.63,29.53 86.36,28.26 86.36,27.3 85.09,26.04 81.79,26.04 N2.5 80.45,27.5 78.42,29.53 74.93,29.53 73.66,28.26 59.69,28.26 58.42,29.53 54.93,29.53 53.98,28.57 53.98,27.3 53.02,26.35 49.09,26.35 N3.5 39.62,27.37 37.78,29.21 33.66,29.21 32.7,28.26 32.7,27.3 31.75,26.35 27.94,26.35 26.93,27.37 N4.5 26.73,27.3 24.45,27.3 22.23,25.08 22.23,22.54 20.32,20.64 20.32,19.68 19.68,19.05 IC1.11
K_6
  Bottom 0.254: N3.6 51.96,28.37 | N3.6 53.87,30.16 58.74,30.16 60.01,28.89 73.34,28.89 74.61,30.16 82.87,30.16 84.45,28.57 N2.6 86.25,30.16 103.82,30.16 105.62,28.37 N1.6 | IC1.10 19.37,20.32 19.68,20.64 19.68,20.95 21.59,22.86 21.59,25.72 25.4,29.53 29.64,29.53 N4.6 31.23,28.37 32.7,29.84 39.05,29.84 39.37,29.53 50.91,29.53 N3.6
K_7
  Bottom 0.254: N1.7 109.73,27.18 107.63,25.08 101.6,25.08 100.97,25.72 98.11,25.72 96.52,27.3 88.52,27.3 N2.7 86.17,25.08 80.33,25.08 79.69,25.72 73.34,25.72 71.44,27.62 58.42,27.62 58.16,27.37 N3.7 55.94,27.37 53.98,25.4 47.31,25.4 46.67,26.04 42.86,26.04 42.23,26.67 35.49,26.67 N4.7 32.83,25.4 26.04,25.4 25.4,26.04 24.45,26.04 23.18,24.77 23.18,22.23 20.95,20 20.95,19.05 19.68,17.78 IC1.12
K_8
  Bottom 0.254: N1.8 103.88,23.87 101.28,21.27 92.8,21.27 N2.8 88.64,23.87 87.95,23.18 81.28,23.18 79.69,21.59 75.56,21.59 70.8,26.35 60.33,26.35 59.69,25.72 59.67,25.72 N3.8 56.25,23.87 55.24,22.86 48.58,22.86 47.31,21.59 38.83,21.59 N4.8 36.49,23.81 34.92,23.81 34.29,23.18 28.89,23.18 26.99,21.27 24.13,21.27 22.86,20 22.86,18.73 21.59,17.46 21.59,16.83 20,15.24 IC1.14
K_9
  Bottom 0.254: N1.9 111.12,19.37 107.63,15.88 102.55,15.88 101.6,16.83 92.75,16.83 N2.9 89.22,19.37 86.04,16.19 81.92,16.19 81.28,16.83 77.79,16.83 75.25,19.37 N3.9 54.65,16.19 49.85,16.19 48.9,17.14 39.05,17.14 36.83,19.37 N4.9 35.88,19.37 32.7,16.19 27.62,16.19 26.67,17.14 23.81,17.14 22.86,16.19 22.86,15.24 20.32,12.7 IC1.16
K_DP
  Bottom 0.254: N1.LHDP 104.89,9.53 85.41,9.53 84.56,10.37 N2.LHDP 83.61,9.53 76.52,9.53 70.8,15.24 64.77,15.24 59.05,9.53 53.02,9.53 52.18,10.37 N3.LHDP 51.23,9.53 31.64,9.53 N4.LHDP 29.1,10.37 27.94,9.21 22.54,9.21 20,6.67 20,6.35 19.68,6.03 IC2.13
K_PS
  Top 0.254: N5.K 69.86,14.28 68.9,15.24 68.9,20.64 69.85,21.59 N6.K
  Bottom 0.254: IC2.14 19.68,4.76 20.64,5.71 20.64,6.35 22.86,8.57 27.94,8.57 28.26,8.26 66.67,8.26 67.31,8.89 68.28,8.89 N5.K
N$1
  Top 0.254: T2.2 111.12,31.75 115.25,27.62 115.25,26.67 Q10.B
N$2
  Top 0.406: T2.3 114.47,37.61 114.62,37.47 118.43,37.47 L1.3
  Top 0.813: L1.3 119.78,37.38 121.6,35.56 121.6,34.7 L4.2 121.51,25.5 122.56,24.45 Q10.C
  Bottom 0.813: Q10.C 122.56,19.37 124.14,17.78 D6.A
N$3
  Top 0.254: Q8.1 R43.2 R6.1
N$4
  Top 0.254: R46.2 Q2.1
N$5
  Top 0.254: Q8.3 36.83,5.57 R48.2
N$6
  Top 0.254: R5.1 R49.2 Q7.1
N$7  (via drill 0.6 pad 1.68)
  Top 0.254: C2.+ 10.12,34.29 R7.2 8.57,35.88 9.84,37.15 9.84,37.78 v10.79,38.73
  Bottom 0.254: U5.1 12.13,36.76 11.43,37.47 11.43,38.1 v10.79,38.73
N$8
  Top 0.406: D1.C R7.1
N$9
  Top 0.254: R79.1 109.08,35.56 T2.1
N$10  (via drill 0.5 pad 1.42)
  Top 0.254: U1.1 3.13,40.01 v3.81,40.01 4.13,39.69 R19.1
  Bottom 0.254: U5.43 7.02,36.2 5.71,36.2 3.81,38.1 v3.81,40.01
N$11  (via drill 0.5 pad 1.42)
  Top 0.254: U1.2 2.22,38.73 2.54,38.42 2.54,36.83 3.17,36.2 R20.1 v4.13,34.61
  Bottom 0.254: U5.42 6.95,35.56 5.4,35.56 4.76,36.2 4.76,35.24 v4.13,34.61
N$12
  Top 0.406: R8.1 31.75,34.61 32.38,33.97 33.97,33.97 34.29,34.29 T1.1
N$13
  Bottom 0.254: U5.30 6.67,27.03 6.67,26.04 5.4,24.77 5.4,23.18 JP1.2
N$14
  Top 0.406: T1.3 33.19,37.32 JP3.1
N$15
  Top 0.813: L4.1 125.73,34.83 125.73,35.88 127.24,37.38 L1.1 128.51,35.64 130.49,33.66 JP2.2
N$16  (via drill 1.5 pad 6.45)
  other vias: 3.17,3.17
N$17
  Top 0.254: N6.A 66.67,23.8 66.67,21.59 67.63,20.64 67.63,15.24 66.66,14.28 N5.A R9.1
N$19
  Top 0.254: Q3.1 R50.2
N$20
  Top 0.254: Q7.3 58.1,5.57 R51.2
N$22
  Top 0.254: R3.2 Q9.3
N$23
  Top 0.254: R5.2 Q3.3
N$24
  Top 0.254: Q2.3 R6.2
N$25
  Top 0.254: Q6.3 R4.2
N$26
  Bottom 0.254: U5.44 7.94,35.99 7.94,37.15 7.93,37.15 R1.2
N$27
  Bottom 0.254: R2.2 85.09,37.4 S11.2
N$28
  Bottom 0.254: U5.34 6.02,29.21 3.17,29.21 2.54,29.84 JP30.2
N$29
  Bottom 0.254: U5.37 5.64,33.34 3.49,33.34 JP30.1
N$30
  Bottom 0.254: U5.31 6.03,27.1 6.03,26.35 4.76,25.08 4.76,23.5 3.81,22.54 3.17,22.54 1.91,23.81 JP1.1
N$31
  Bottom 0.254: S10.2 66,38.45 R24.2 68.58,36.83 69.22,36.2 69.22,34.92 70.48,33.66 73.98,33.66 75.25,32.38 82.55,32.38 R2.1
N$32
  Top 0.254: R51.1 58.1,9.34 | 58.1,9.34 N3.A | 58.1,9.34 58.1,10.16 58.74,9.53 58.74,9.21 59.37,9.84 59.37,10.16 60.01,9.53 60.01,9.21 60.64,9.84 60.64,10.16 61.28,9.53 61.28,9.21 61.91,9.84 61.91,10.48 62.23,10.79 62.55,10.79 R9.2
N$36
  Bottom 0.254: U5.6 15.44,36.51 20.13,36.51 Q19.1 23.5,37.47 25.08,35.88 27.26,35.88 C25.1
N$39
  Bottom 0.254: U5.5 15.37,37.15 18.73,37.15 20.32,38.73 24.64,38.73 Q19.2 26.54,38.1 C23.2
N$42
  Top 0.254: C11.1 Q20.2
  Bottom 0.254: U5.3 13.65,36.84 13.65,37.47 Q20.2
N$43
  Top 0.254: Q20.1 C10.2
  Bottom 0.254: U5.4 14.29,36.77 14.29,37.47 Q20.1
N$44
  Top 0.254: Q5.1 R52.2 R4.1
N$59  (via drill 1.5 pad 6.45)
  other vias: 133.99,3.17
N$61
  Top 0.254: R53.2 Q6.1
N$62
  Top 0.254: Q5.3 89.68,5.23 R57.2
N$64  (via drill 1.5 pad 6.45)
  other vias: 59.37,36.83
N$66  (via drill 1.5 pad 6.45)
  other vias: 77.15,36.83
N$72
  Top 0.254: Q4.1 R59.2 R3.1
N$76
  Top 0.254: R71.2 Q9.1
N$87
  Top 0.305: Q4.3 110.95,5.23 R73.2
N$95
  Top 0.254: R57.1 90.49,9.34 N2.A
N$97
  Top 0.254: R73.1 111.76,9.34 N1.A
N$99
  Bottom 0.254: D7.A 21.59,3.15 21.59,2.54 20.32,1.27 17.14,1.27 16.51,1.91 16.51,10.48 17.14,11.11 | 17.14,11.11 IC2.9 | 17.14,11.11 16.51,11.75 16.51,20.95 17.14,21.59 IC1.9
N$105
  Top 0.254: R48.1 36.83,9.34 N4.A
N$157
  Bottom 0.254: 49.21,34.92 48.26,33.97 46.35,33.97 44.77,32.38 42.23,32.38 | U5.10 16.05,34.29 17.78,34.29 20,32.07 23.81,32.07 24.13,32.38 | 24.13,32.38 42.23,32.38 | R90.2 24.76,33.02 24.13,32.38 | 49.21,34.92 49.21,37.72 S1.2 | 49.21,34.92 50.8,33.34 56.2,33.34 56.83,32.7 65.41,32.7 66.04,33.34 67.31,33.34 67.63,33.65 R24.1 | C1.1 43.5,33.66 42.23,32.38
N$163
  Top 0.254: LED2.C R85.2
PWM  (via drill 0.6 pad 1.68)
  Top 0.254: 105.05,36.15 R79.2 104.14,35.56 102.23,33.66 93.66,33.66 91.76,31.75 71.44,31.75 69.85,33.34 65.72,33.34 64.14,31.75 26.35,31.75 21.91,27.3 20.64,27.3 20,27.94 20,29.84 v18.73,31.11
  Bottom 0.254: U5.11 16.12,33.66 16.83,33.66 18.73,31.75 v18.73,31.11
RES  (via drill 0.6 pad 1.68)
  Top 0.254: R86.1 7.3,28.57 14.92,28.57 15.24,28.89 15.24,32.7 16.51,33.97 v21.27,33.97 C27.1
  Bottom 0.254: U5.7 15.2,35.56 19.68,35.56 v21.27,33.97
SOUND  (via drill 0.6 pad 1.68)
  Top 0.254: v21.59,28.89 23.18,30.48 24.13,30.48 28.26,34.61 R8.2
  Bottom 0.254: U5.15 17.4,27.94 20.95,27.94 21.59,28.57 v21.59,28.89
VDD  (via drill 0.6 pad 1.68)
  Top 0.254: R19.2 R20.2 6.03,33.97 4.76,32.7 v4.76,31.43 4.45,31.43 4.13,31.11 R86.2
  Top 0.406: C20.2 4.76,24.08 4.76,25.4 3.49,26.67 3.49,28.57 4.13,29.21 R86.2 | U1.5 U1.6 U1.7 U1.8 2.88,33.31 v4.76,31.43
  Top 0.813: IC11.2 6.96,12.09 6.35,12.7 | 6.03,16.79 6.03,19.33 C19.+ 6.62,19.91 C20.2 6.62,24.11 D1.A | 6.35,12.7 6.07,12.98 C5.+ 6.03,16.79 | JP28.1 3.81,10.16 6.03,12.38 | 6.03,12.38 6.35,12.7 | LED2.A 5.3,9.74 6.03,10.48 6.03,12.38 | 6.03,16.79 6.03,15.88
  Bottom 0.254: U5.24 11.59,27.39 11.59,28.26 7.94,31.27 | 7.94,31.27 6.67,31.27 U5.36 5.47,30.73 v4.76,31.43 | U5.48 10.84,35.92 10.84,35.52 | 7.94,31.27 10.84,34.81 10.84,35.52 | 10.84,35.52 13.02,33.34 14.39,33.34 U5.9 15.98,34.92 18.1,34.92 20.32,32.7 22.54,32.7 22.86,33.02 R90.1 22.86,34.92 23.18,35.24 25.72,35.24 26.35,34.61 26.35,33.66 27.94,33.66 28.57,33.02 36.2,33.02 36.83,33.66 JP3.2
VDD_5V
  Top 0.813: IC11.3 12.45,14.29 15.56,14.29 18.1,11.75 18.1,3.17 19.68,1.59 121.62,1.59 D18.C 124.48,5.42 127.95,8.89 127.95,13.97 X2.1 128.91,15.56 129.86,16.51 129.86,17.78 129.54,18.1 129.54,22.23 132.08,24.77 JP2.1

### Text on the board
Top: MK_std_v1.115 | > 5V < 12V
Bottom: NIXIE_CLOCK_v1.1/13